# Altium project Doku_Objekte.PrjPcb
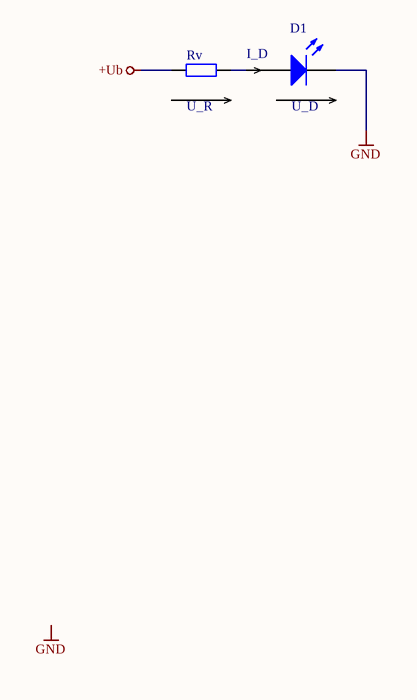
[diagram p0: LED.SchDoc]
1 sheet, 2 parts. Net scope: global (net labels, ports and power ports of the same name join across sheets).

## Sheet LED.SchDoc
size A4; SheetNumber: 2; SheetTotal: 2; SPICEModelCacheFRKQGAMO: <root> / <DocumentId>FRKQGAMO</DocumentId> / <CacheFrame Number="0"> / <Model Name="led_blue" Kind="MDL"> / <Text>*Typ BLUE SiC LED: Vf=3.4V Vr=5V If=40mA trr=3uS / *LED Pinout: 1=A, 2=K / .MODEL LED_BLUE D (IS=93.1P RS=42M N=7.47 BV=5 IBV=30U / + CJO=2.97P VJ=.75 M=.333 TT=4.32U)</Text> / </Model> / </CacheFrame> / </root>

### Parts
D1  LED BLUE  [LED_5MM - blue]  (value not drawn)
Rv  1K  [R_0207/RM4]  (value not drawn)

### Nets
+Ub: Rv.1
GND: D1.K
NetD1_A: D1.A Rv.2

### Notes on the sheet
- I_D
- (near Rv) U_R
- (near D1) U_D
- Labels drawn without touching a wire or pin: GND

### Library data of the parts
D1 = LED_BLUE: Blue SiC LED (Vf=3.4V, If=40mA); Usage: only permitted for non-commercial purposes at HTL I Innsbruck; SimulationModellSource: Miscellaneous Devices; Published: 21-Feb-2011; LatestRevisionDate: 01-Nov-2013
Rv = R: Resistor; Usage: only permitted for non-commercial purposes at HTL I Innsbruck; Published: 21-Feb-2011; LatestRevisionDate: 07-Sep-2019; Value: 1K